# Altium schematic sheet Ethernet.SchDoc: Ethernet PHY with RJ45 connector
size A4; Author: A.B; CompanyName: STMicroelectronics; Address1: 12, Rue Jules HOROWITZ; Address2: 38019 Grenoble; Address3: FRANCE; DocumentNumber: MB1137; Revision: B-01; SheetNumber: 5; SheetTotal: 6; Project: NUCLEO-XXXXZX
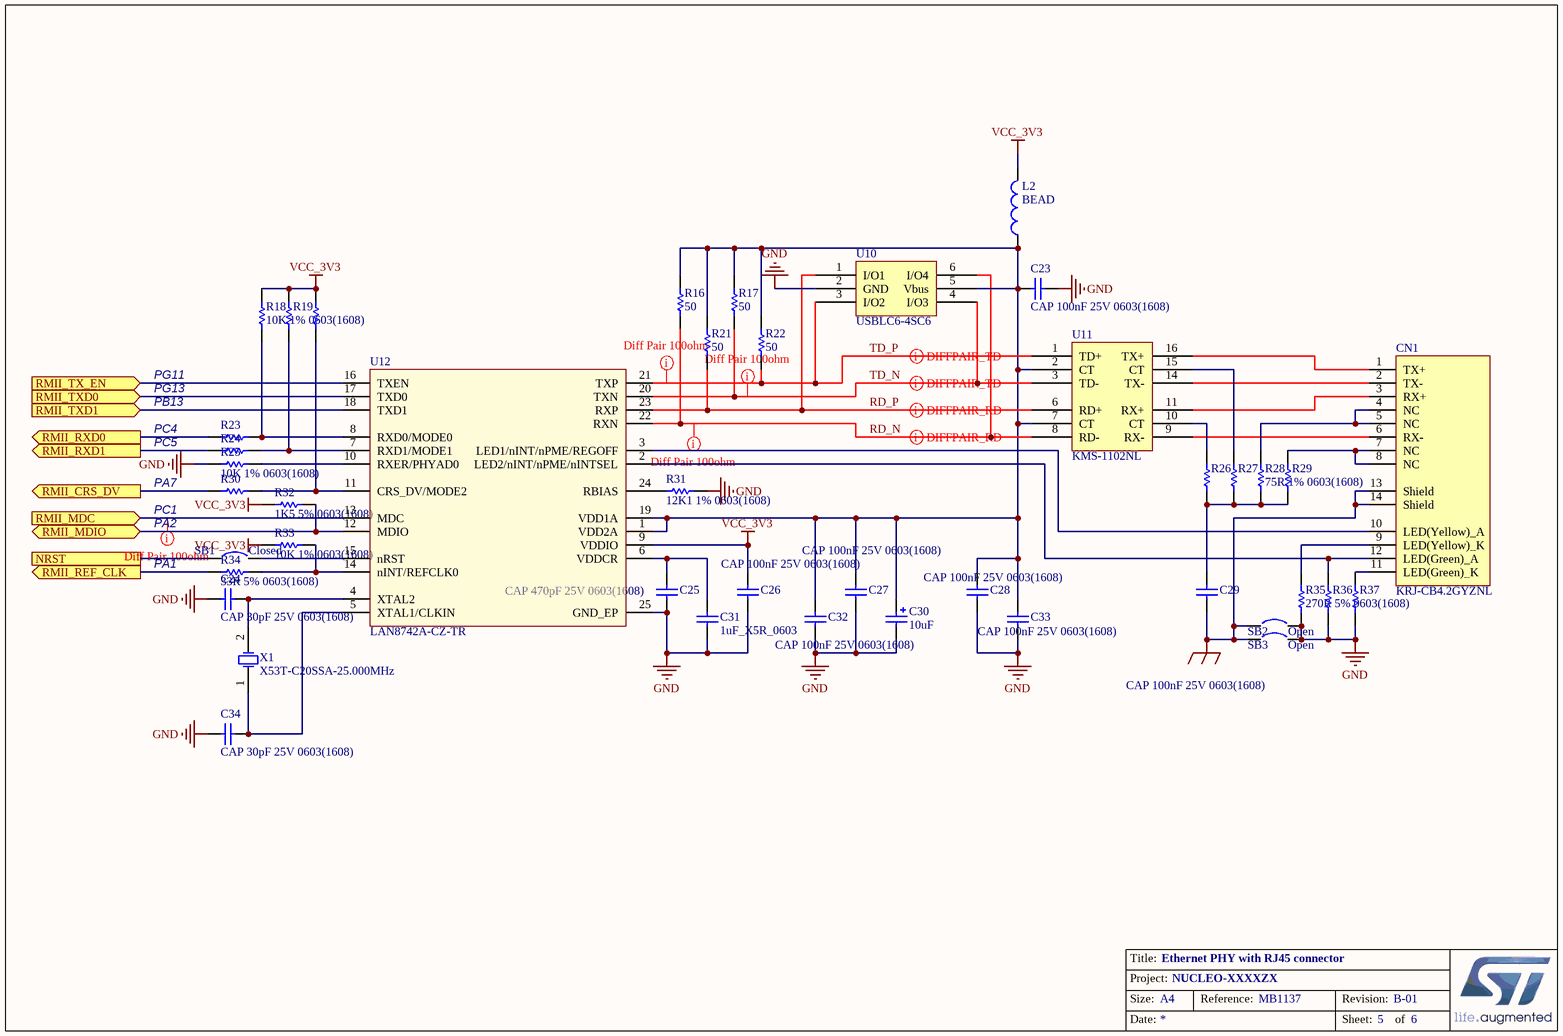
[diagram p0: Ethernet.SchDoc]

## Parts
C23  CAP 100nF 25V 0603(1608)  [CAPC0603(1608)100_N]
C24  CAP 30pF 25V 0603(1608)  [CAPC0603(1608)100_N]
C25  CAP 470pF 25V 0603(1608)  [CAPC0603(1608)100_M]
C26  CAP 100nF 25V 0603(1608)  [CAPC0603(1608)100_N]
C27  CAP 100nF 25V 0603(1608)  [CAPC0603(1608)100_N]
C28  CAP 100nF 25V 0603(1608)  [CAPC0603(1608)100_N]
C29  CAP 100nF 25V 0603(1608)  [CAPC0603(1608)100_N]
C30  10uF  [TAN-A]
C31  1uF_X5R_0603  [0603C]
C32  CAP 100nF 25V 0603(1608)  [CAPC0603(1608)100_N]
C33  CAP 100nF 25V 0603(1608)  [CAPC0603(1608)100_N]
C34  CAP 30pF 25V 0603(1608)  [CAPC0603(1608)100_N]
CN1  KRJ-CB4.2GYZNL  [RJ45_KRJ-CB4.2GYZNL]
L2  BEAD  [0603L]
R16  50  [0603R]
R17  50  [0603R]
R18  10K 1% 0603(1608)  [RESC0603(1608)_N]
R19  10K 1% 0603(1608)  [RESC0603(1608)_N]  (value not drawn)
R20  10K 1% 0603(1608)  [RESC0603(1608)_N]  (value not drawn)
R21  50  [0603R]
R22  50  [0603R]
R23  33R 5% 0603(1608)  [RESC0603(1608)_M]  (value not drawn)
R24  33R 5% 0603(1608)  [RESC0603(1608)_M]  (value not drawn)
R25  10K 1% 0603(1608)  [RESC0603(1608)_N]
R26  75R 1% 0603(1608)  [RESC0603(1608)_M]  (value not drawn)
R27  75R 1% 0603(1608)  [RESC0603(1608)_M]  (value not drawn)
R28  75R 1% 0603(1608)  [RESC0603(1608)_M]
R29  75R 1% 0603(1608)  [RESC0603(1608)_M]  (value not drawn)
R30  33R 5% 0603(1608)  [RESC0603(1608)_M]  (value not drawn)
R31  12K1 1% 0603(1608)  [RESC0603(1608)_M]
R32  1K5 5% 0603(1608)  [RESC0603(1608)_M]
R33  10K 1% 0603(1608)  [RESC0603(1608)_N]
R34  33R 5% 0603(1608)  [RESC0603(1608)_M]
R35  270R 5% 0603(1608)  [RESC0603(1608)_N]
R36  270R 5% 0603(1608)  [RESC0603(1608)_N]  (value not drawn)
R37  270R 5% 0603(1608)  [RESC0603(1608)_N]  (value not drawn)
SB1  Closed  [SB_0603]
SB2  Open  [SB_0603]
SB3  Open  [SB_0603]
U10  USBLC6-4SC6  [SOT23-6L]
U11  KMS-1102NL  [Transformer]
U12  LAN8742A-CZ-TR  [QFN24_0R5_4X4]
X1  X53T-C20SSA-25.000MHz  [XTAL_2SM_5R0X3R2]

## Ports
NRST, RMII_CRS_DV (out), RMII_MDC (in), RMII_MDIO (bidir), RMII_REF_CLK (out), RMII_RXD0 (out), RMII_RXD1 (out), RMII_TX_EN (in), RMII_TXD0 (in), RMII_TXD1 (in)

## Nets
EGND: C29.1 CN1.13(Shield) CN1.14(Shield) SB2.1 SB3.1
GND: C23.2 C24.1 C25.1 C26.1 C27.1 C28.1 C30.2 C31.2 C32.1 C33.1 C34.1 R25.1 R31.2 R35.1 R36.1 R37.1 SB2.2 SB3.2 U10.2(GND) U12.25(GND_EP)
VCC_3V3: C26.2 L2.2 R18.2 R19.2 R20.2 R32.1 R33.1 U12.9(VDDIO)
NRST: SB1.1 ; port NRST
RD_N: R16.1 U10.6(I/O4) U11.8(RD-) U12.22(RXN)
RD_P: R21.1 U10.1(I/O1) U11.6(RD+) U12.23(RXP)
RMII_CRS_DV: R30.1 ; port RMII_CRS_DV
RMII_MDC: U12.13(MDC) ; port RMII_MDC
RMII_MDIO: R32.2 U12.12(MDIO) ; port RMII_MDIO
RMII_REF_CLK: R34.1 ; port RMII_REF_CLK
RMII_RXD0: R23.1 ; port RMII_RXD0
RMII_RXD1: R24.1 ; port RMII_RXD1
RMII_TX_EN: U12.16(TXEN) ; port RMII_TX_EN
RMII_TXD0: U12.17(TXD0) ; port RMII_TXD0
RMII_TXD1: U12.18(TXD1) ; port RMII_TXD1
TD_N: R17.1 U10.4(I/O3) U11.3(TD-) U12.20(TXN)
TD_P: R22.1 U10.3(I/O2) U11.1(TD+) U12.21(TXP)
NetC23_1: C23.1 C27.2 C28.2 C30.1 C32.2 C33.2 L2.1 R16.2 R17.2 R21.2 R22.2 U10.5(Vbus) U11.2(CT) U11.7(CT) U12.1(VDD2A) U12.19(VDD1A)
NetC24_2: C24.2 U12.4(XTAL2) X1.2(OSC2)
NetC25_2: C25.2 C31.1 U12.6(VDDCR)
NetC29_2: C29.2 R26.1 R27.1 R28.1 R29.1
NetC34_2: C34.2 U12.5(XTAL1/CLKIN) X1.1(OSC1)
NetCN1_1: CN1.1(TX+) U11.16(TX+)
NetCN1_2: CN1.2(TX-) U11.14(TX-)
NetCN1_3: CN1.3(RX+) U11.11(RX+)
NetCN1_4: CN1.4(NC) CN1.5(NC) R28.2
NetCN1_6: CN1.6(RX-) U11.9(RX-)
NetCN1_7: CN1.7(NC) CN1.8(NC) R29.2
NetCN1_9: CN1.9(LED(Yellow)_K) R35.2
NetCN1_10: CN1.10(LED(Yellow)_A) U12.3(LED1/nINT/nPME/REGOFF)
NetCN1_11: CN1.11(LED(Green)_K) R37.2
NetCN1_12: CN1.12(LED(Green)_A) R36.2 U12.2(LED2/nINT/nPME/nINTSEL)
NetR18_1: R18.1 R23.2 U12.8(RXD0/MODE0)
NetR19_1: R19.1 R24.2 U12.7(RXD1/MODE1)
NetR20_1: R20.1 R30.2 U12.11(CRS_DV/MODE2)
NetR25_2: R25.2 U12.10(RXER/PHYAD0)
NetR26_2: R26.2 U11.10(CT)
NetR27_2: R27.2 U11.15(CT)
NetR31_1: R31.1 U12.24(RBIAS)
NetR33_2: R33.2 R34.2 U12.14(nINT/REFCLK0)
NetSB1_2: SB1.2 U12.15(nRST)

## Layout directives
differential pair: RD_N, RD_P, TD_N, TD_P
rule Matched Net Lengths [Tolerance = 100mil]: RD_N, RMII_MDC, TD_N, TD_P

## Notes on the sheet
- PG11
- PG13
- PB13
- PC4
- PC5
- PA7
- PC1
- PA2
- PA1
- Title:
- Project:
- Size:
- Date:
- A4
- Reference:
- Sheet:
- Revision:
- of

## Library data of the parts
C23 C26-C29 C32 C33 = CMP-1035-02587-1: CAP 100nF 25V ±5% 0603 (1608 Metric) Thickness 1mm SMD; Case-EIA: 0603; Tolerance: Â±5%; Case-Metric: 1608; Technology: SMT; Max Thickness: 1 mm; Rated Voltage: 25 V; Value: 100nF
C24 C34 = CMP-1035-00910-1: CAP 30pF 25V ±5% 0603 (1608 Metric) Thickness 1mm SMD; Case-EIA: 0603; Tolerance: Â±5%; Case-Metric: 1608; Max Thickness: 1 mm; Technology: SMT; Value: 30pF; Rated Voltage: 25 V
C25 = CMP-1035-01670-1: CAP 470pF 25V ±5% 0603 (1608 Metric) Thickness 1mm SMD; Tolerance: Â±5%; Case-Metric: 1608; Case-EIA: 0603; Rated Voltage: 25 V; Value: 470pF; Max Thickness: 1 mm; Technology: SMT
C30 = Cap_10uF_POL_10%_TANA: Polarized Capacitor,10uF,10V,10%,typeA,VISHAY; Manuf_Part_1: 293D106X9010A2TE3; Revision: July-2002: Re-released for DXP Platform.; Value: 10uF; Manuf_1: VISHAY; Order: *; ECCN_US/EU: n/a
C31 = CAP SMD 0603  X5R 1µF 25V 10%: 0603  X5R 1µF; Rated voltage: 25V; Tolerance: 10%; Manufacturer: *; Manufacturer P/N: *; Order code Farnell: 1288202RL; Value: 1µF; Power: *; Technology: X5R; Temperature  Factor: *; Temperature Max: +125°C; Temperature Min: -55°C; STS Code: *
CN1 = KRJ-CB4.2GYZNL: 100 Base-TX (Fast Ethernet) SMD RJ45 single port (1x1) with LEDS Integrated Magnetics Connector; Manuf_1: HanRun; Manuf_Part_1: HR961160C; Manuf_2: Pulse Electronics Corporation; Manuf_Part_2: J3011G21DNLT; Manuf_3: K.O.D International Holding; Manuf_Part_3: RMT-119A-12F6-GY-04; Distrib: Sub Co; Order: *
L2 = Inductor: Value: 100uH; Published: 8-Jun-2000; Revision: July-2002: Re-released for DXP Platform.; Publisher: Altium Limited
R16 R17 R21 R22 = Res_50_1%_0603: Resistor,50,0603,1%,YAGEO; Manuf_Part_1: RC0402FR-0750RL; Value: 50; Manuf_1: YAGEO; Order: *; ECCN_US/EU: n/a; Distrib: FARNELL
R18-R20 R25 R33 = CMP-1012-00623-1: 10K 0.1W 1% 0603 (1608 Metric)  SMD; Value: 10000.00 Ohm; Case-EIA: 0603; Case-Metric: 1608; Power: 0.1 W; Tolerance: 1 %; Technology: SMT
R23 R24 R30 R34 = CMP-1012-00038-1: 33R 0.1W 5% 0603 (1608 Metric)  SMD; Value: 33.00 Ohm; Case-EIA: 0603; Case-Metric: 1608; Tolerance: 5 %; Technology: SMT; Power: 0.1 W
R26-R29 = CMP-1012-00383-1: 75R 0.1W 1% 0603 (1608 Metric)  SMD; Case-EIA: 0603; Value: 75.00 Ohm; Case-Metric: 1608; Power: 0.1 W; Technology: SMT; Tolerance: 1 %
R31 = CMP-1012-00632-1: 12K1 0.1W 1% 0603 (1608 Metric)  SMD; Case-Metric: 1608; Case-EIA: 0603; Value: 12100.00 Ohm; Power: 0.1 W; Technology: SMT; Tolerance: 1 %
R32 = CMP-1012-00078-1: 1K5 0.1W 5% 0603 (1608 Metric)  SMD; Case-Metric: 1608; Case-EIA: 0603; Value: 1500.00 Ohm; Technology: SMT; Power: 0.1 W; Tolerance: 5 %
R35-R37 = CMP-1012-00060-1: 270R 0.1W 5% 0603 (1608 Metric)  SMD; Case-Metric: 1608; Case-EIA: 0603; Value: 270.00 Ohm; Power: 0.1 W; Tolerance: 5 %; Technology: SMT
SB1 = Circuit Breaker_close: Circuit Breaker; Published: 24-Mar-1999; Revision: July-2002: Re-released for DXP Platform.; Publisher: Altium Limited
SB2 SB3 = Circuit Breaker: Published: 24-Mar-1999; Revision: July-2002: Re-released for DXP Platform.; Publisher: Altium Limited
U12 = LAN8742A-CZ-TR: LAN8742A-CZ-TR - Small Footprint RMII 10/100 Ethernet, Transceiver with HP Auto-MDIX and flexPWR Technology SQFN-24; Manuf_1: MICROCHIP; Order: LAN8742A-CZ-TR; Manuf_Part_1: LAN8742A-CZ-TR; Distrib: MICROCHIP
X1 = XTAL_5032: Crystal Oscillator; Published: 8-Jun-2000; LatestRevisionDate: 17-Jul-2002; LatestRevisionNote: Re-released for DXP Platform.; PackageReference: R38; Publisher: Altium Limited